# Altium schematic sheet 电源模块.SchDoc: 电源模块
size A4; Author: GAOYANG; Organization: Altium Limited; Address1: L3, 12a Rodborough Rd; Address2: Frenchs Forest; Address3: NSW; Address4: Australia 2086
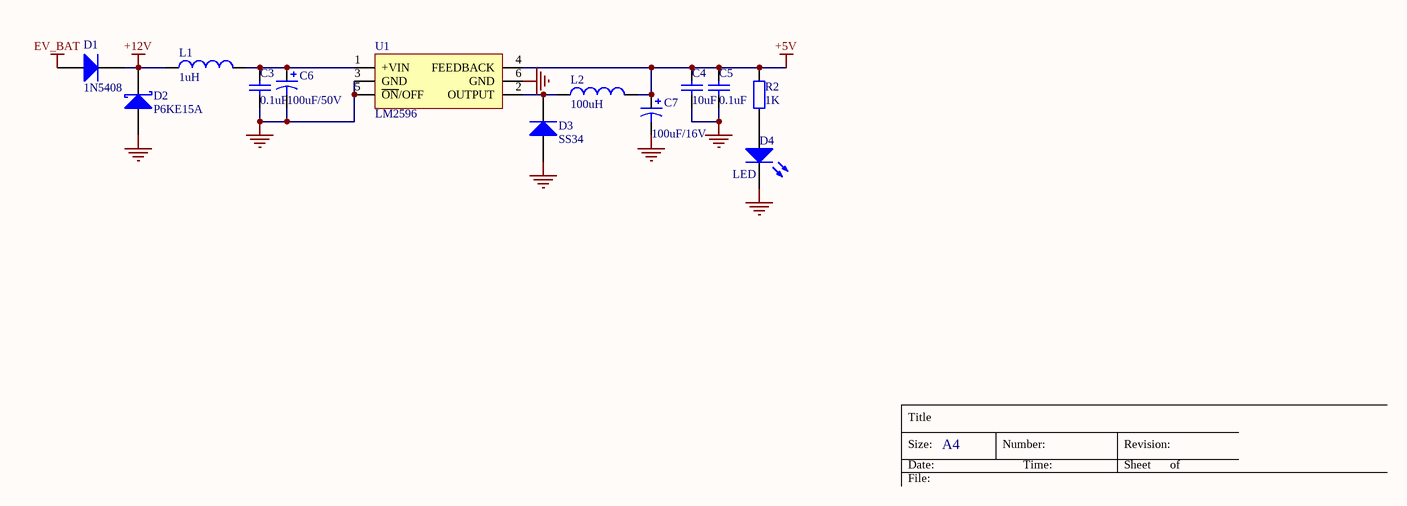
[diagram p0: 电源模块.SchDoc]

## Parts
C3  value 0.1uF  [0603-L]  (hidden comment: Cap)
C4  value 10uF  [0603-L]  (hidden comment: Cap)
C5  value 0.1uF  [0603-L]  (hidden comment: Cap)
C6  value 100uF/50V  [CAP220uF,16V,6.3*7.7mm]  (hidden comment: Cap Pol1)
C7  value 100uF/16V  [CAP220uF,16V,6.3*7.7mm]  (hidden comment: Cap Pol1)
D1  1N5408  [DO-201AD]
D2  P6KE15A  [P6KE15A]
D3  SS34  [SMC]
D4  LED  [0603-L]
L1  value 1uH  [0603-L]  (hidden comment: Inductor)
L2  value 100uH  [IND-10*10*5]  (hidden comment: Inductor)
R2  value 1K  [0603-L]  (hidden comment: Res2)
U1  LM2596  [TO263, LM2576]

## Nets
+5V: C4.2 C5.2 C7.1 L2.2 R2.1 U1.4(FEEDBACK)
+12V: D1.2(K) D2.2(K) L1.1
EV_BAT: D1.1(A)
GND: C3.1 C4.1 C5.1 C6.2 C7.2 D2.1(A) D3.1(A) D4.2(K) U1.3(GND) U1.5(~{ON}/OFF) U1.6(GND)
NetC3_2: C3.2 C6.1 L1.2 U1.1(+VIN)
NetD3_2: D3.2(K) L2.1 U1.2(OUTPUT)
NetD4_1: D4.1(A) R2.2

## Notes on the sheet
- Title
- Size:
- Date:
- A4
- Number:
- Time:
- Revision:
- Sheet
- of
- File:

## Library data of the parts
C3 C5 = Cap: Ceramic, X7R, 100V, 10%, 0603; Published: 8-Jun-2000; LatestRevisionDate: 17-Jul-2002; LatestRevisionNote: Re-released for DXP Platform.; PackageReference: RAD-0.3; Publisher: Altium Limited; PackageDescription: Radial Cap, Thru-Hole; 2 Leads; 0.3 in Pin Spacing
C4 = Cap: Capacitor; Published: 8-Jun-2000; LatestRevisionDate: 17-Jul-2002; LatestRevisionNote: Re-released for DXP Platform.; PackageReference: RAD-0.3; Publisher: Altium Limited; PackageDescription: Radial Cap, Thru-Hole; 2 Leads; 0.3 in Pin Spacing
C6 C7 = Cap Pol1: Polarized Capacitor (Radial); Published: 8-Jun-2000; LatestRevisionDate: 17-Jul-2002; LatestRevisionNote: Re-released for DXP Platform.; PackageReference: RB7.6-15; Publisher: Altium Limited; PackageDescription: Polarized Capacitor (Radial); 2 Leads
D1 D3 = Diode 1N5408: 3 Amp Medium Power Silicon Rectifier Diode; Published: 8-Jun-2000; LatestRevisionDate: 17-Jul-2002; LatestRevisionNote: Re-released for DXP Platform.; DatasheetVersion: Aug-1984; PackageReference: DO-201AD; Publisher: Altium Limited; PackageDescription: Diode, Axial; Body 9.5 x 5.3 mm (LxDia. max), Lead Dia. 1.32 mm (max); ComponentLink1Description: Manufacturer Link; ComponentLink1URL: http://www.irf.com/
D2 = D Schottky: Schottky Diode; Published: 8-Jun-2000; LatestRevisionDate: 17-Jul-2002; LatestRevisionNote: Re-released for DXP Platform.; PackageReference: SMB; Publisher: Altium Limited; PackageDescription: DO-214-AA/SMB; 2 C-Bend Leads; Body 5.3 x 3.6 mm, inc. leads (LxW); Code_JEDEC: DO-214-AA
D4 = LED0: Typical INFRARED GaAs LED; Published: 8-Jun-2000; LatestRevisionDate: 08-Jul-2005; LatestRevisionNote: Mech Layer 1 removed.; PackageReference: LED-0; Publisher: Altium Limited; PackageDescription: LED; 2 Leads
L1 L2 = Inductor: Code_IEC: 1005; Published: 8-Jun-2000; LatestRevisionDate: 29-May-2009; LatestRevisionNote: IPC-7351 Footprint Added.; PackageReference: 0402-A; Publisher: Altium Limited; PackageDescription: Chip Inductor; Code_JEITA: 0402
R2 = Res2: Resistor; Published: 8-Jun-2000; LatestRevisionDate: 17-Jul-2002; LatestRevisionNote: Re-released for DXP Platform.; PackageReference: AXIAL-0.4; Publisher: Altium Limited; PackageDescription: Axial Device, Thru-Hole; 2 Leads; 0.4 in Pin Spacing
U1 = LM2576